# EAGLE design first designbr (EAGLE 7.5.0)
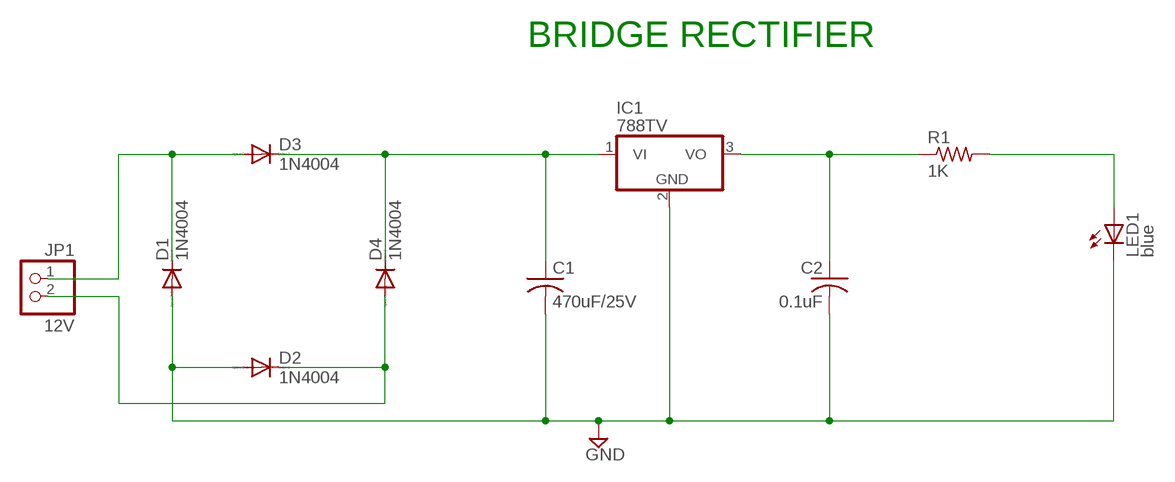
[diagram p0: schematic, sheet 1]

## Parts
C1  470uF/25V  C-US050-025X075  [C050-025X075]
C2  0.1uF  C-US025-024X044  [C025-024X044]
D1  1N4004  [DO41-10]
D2  1N4004  [DO41-10]
D3  1N4004  [DO41-10]
D4  1N4004  [DO41-10]
IC1  788TV  [TO220V]
JP1  12V  PINHD-1X2  [1X02]
LED1  blue  LED5MM  [LED5MM]
R1  1K  R-US_0207/10  [0207/10]

## Nets
GND: C1.2 C2.2 D1.A D2.A IC1.2(GND) LED1.K(C)
N$1: D1.C D3.A JP1.1
N$2: C1.1 D3.C D4.C IC1.1(VI)
N$5: D2.C D4.A JP1.2
N$6: C2.1 IC1.3(VO) R1.1
N$7: LED1.A R1.2

## Notes on the sheet
- BRIDGE RECTIFIER

## Library data of the parts
C1 C2 = rcl:C-US: CAPACITOR, American symbol
D1-D4 = diode:1N4004: DIODE general purpose rectifier, 1 A
IC1 = linear:78*: Positive VOLTAGE REGULATOR Source: http://cache.national.com/ds/LM/LM78L05.pdf http://www.fairchildsemi.com/ds/LM/LM7805.pdf
JP1 = pinhead:PINHD-1X2: PIN HEADER
LED1 = led:LED: LED OSRAM: - CHIPLED LG R971, LG N971, LY N971, LG Q971, LY Q971, LO R971, LY R971 LH N974, LH R974 LS Q976, LO Q976, LY Q976 LO Q996 - Hyper CHIPLED LW Q18S LB Q993, LB Q99A, LB R99A - SideLED LS A670, LO A670, LY A670, LG A670, LP A670 LB A673, LV A673, LT A673, LW A673 LH A674 LY A675 LS A676, LA A676, LO A676, LY A676, LW A676 LS A679, LY A679, LG A679 - Hyper Micro SIDELED® LS Y876, LA Y876, LO Y876, LY Y876 LT Y87S - SmartLED LW L88C, LW L88S LB L89C, LB L89S, LG L890 LS L89K, LO L89K, LY L89K LS L896, LA L896, LO L896, LY L896 - TOPLED LS T670, LO T670, LY T670, LG T670, LP T670 LSG T670, LSP T670, LSY T670, LOP T670, LYG T670 LG T671, LOG T671, LSG T671 LB T673, LV T673, LT T673, LW T673 LH T674 LS T676, LA T676, LO T676, LY T676, LB T676, LH T676, LSB T676, LW T676 LB T67C, LV T67C, LT T67C, LS T67K, LO T67K, LY T67K, LW E67C LS E67B, LA E67B, LO E67B, LY E67B, LB E67C, LV E67C, LT E67C LW T67C LS T679, LY T679, LG T679 LS T770, LO T770, LY T770, LG T770, LP T770 LB T773, LV T773, LT T773, LW T773 LH T774 LS E675, LA E675, LY E675, LS T675 LS T776, LA T776, LO T776, LY T776, LB T776 LHGB T686 LT T68C, LB T68C - Hyper Mini TOPLED® LB M676 - Mini TOPLED Santana® LG M470 LS M47K, LO M47K, LY M47K Source: http://www.osram.convergy.de LUXEON: - LUMILED® LXK2-PW12-R00, LXK2-PW12-S00, LXK2-PW14-U00, LXK2-PW14-V00 LXK2-PM12-R00, LXK2-PM12-S00, LXK2-PM14-U00 LXK2-PE12-Q00, LXK2-PE12-R00, LXK2-PE12-S00, LXK2-PE14-T00, LXK2-PE14-U00 LXK2-PB12-K00, LXK2-PB12-L00, LXK2-PB12-M00, LXK2-PB14-N00, LXK2-PB14-P00, LXK2-PB14-Q00 LXK2-PR12-L00, LXK2-PR12-M00, LXK2-PR14-Q00, LXK2-PR14-R00 LXK2-PD12-Q00, LXK2-PD12-R00, LXK2-PD12-S00 LXK2-PH12-R00, LXK2-PH12-S00 LXK2-PL12-P00, LXK2-PL12-Q00, LXK2-PL12-R00 Source: www.luxeon.com KINGBRIGHT: KA-3528ASYC Source: www.kingbright.com
R1 = rcl:R-US_: RESISTOR, American symbol

## Board
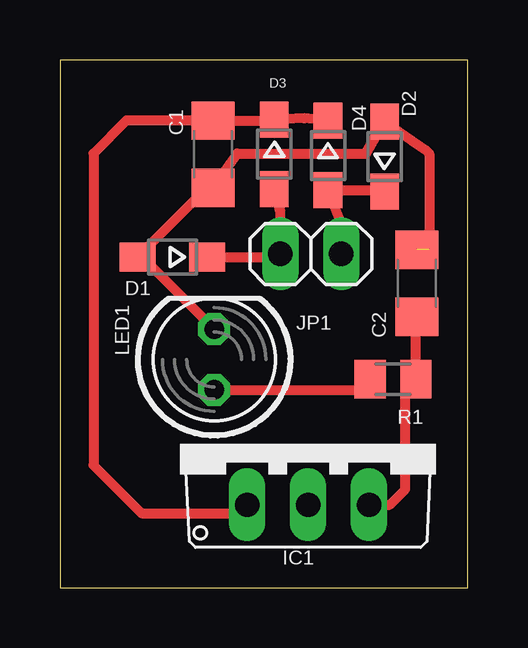
[diagram p1: board, top side]
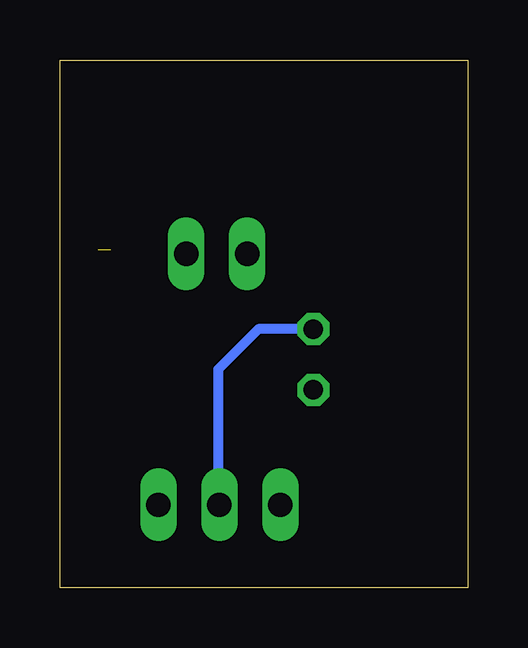
[diagram p2: board, bottom side, seen from below]

Size 17 x 22 mm. Coordinates in mm from the lower left corner, seen from the top.
Outline: 0,0 17,0 17,22 0,22 0,0
Copper layers (1*16): Top 0.035mm / dielectric 1.5mm / Bottom 0.035mm
Design rules "default": minimum track width 10mil, minimum drill 24mil, track to track 8mil, track to pad 8mil, pad to pad 8mil, via to via 8mil, smd to smd 8mil, copper to edge 40mil, drill to drill 8mil, minimum pad ring 10mil, minimum via ring 8mil, stop-mask expansion 4mil, vias tented up to drill 0mil, thermal gap 10mil

### Footprints (pad centres in the part's own frame; a part is rotated, then mirrored left to right if it is on the bottom)
C1206 = smd 1.6 x 1.8: 1 -1.4,0; 2 1.4,0
SOD323-W = smd 1.5 x 1.2: A 1.45,0; C -1.45,0
TO220V = drill 1.016 long: 1 -2.54,-2.54; 2 0,-2.54; 3 2.54,-2.54
1X02 = drill 1.016 long: 1 -1.27,0; 2 1.27,0
LED5MM = drill 0.813 octagon: A -1.27,0; K 1.27,0
M0805 = smd 1.3 x 1.6: 1 -0.95,0; 2 0.95,0

### Placement (x,y rotation side)
C1  470uF/25V  [C1206]  6.38,18.07 270 top
C2  0.1uF  [C1206]  14.88,12.69 90 top
D1  CGRM4002-G  [SOD323-W]  4.69,13.78 180 top
D2  CGRM4002-G  [SOD323-W]  13.54,17.97 90 top
D3  CGRM4002-G  [SOD323-W]  8.94,18.07 270 top
D4  CGRM4002-G  [SOD323-W]  11.18,18.02 270 top
IC1  10.35,5.99 0 top
JP1  10.46,13.91 0 top
LED1  6.43,9.51 90 top
R1  1K  [M0805]  13.89,8.68 180 top

### Tracks (layer width: path | path; a pad name or v marks a point on that pad's centre or on a via)
GND  (1 unrouted)
  Top 0.406: 14.54,14.53 C2.2 | LED1.K 3.43,13.78 D1.A 6.13,16.67 C1.2 7.38,18.08 7.4,18.1 12.76,18.1 D2.A 15.28,18.22 15.4,18.1 15.4,14.1
  Bottom 0.406: LED1.K 8.72,10.78 10.4,9.1 10.4,3.5 IC1.2
N$1
  Top 0.406: D1.C 9.06,13.78 JP1.1 9.19,15.67 D3.A
N$2
  Top 0.406: D4.C 10.19,19.57 D3.C 8.89,19.47 C1.1 2.77,19.47 1.4,18.1 1.4,5.1 3.4,3.1 7.46,3.1 IC1.1
N$5
  Top 0.406: JP1.2 12.08,14.26 D4.A 13.49,16.57 D2.C
N$6
  Top 0.406: IC1.3 13.75,3.45 14.4,4.1 14.4,8.24 R1.1 14.84,11.25 C2.1
N$7
  Top 0.406: LED1.A 12.5,8.24 R1.2